# EasyEDA schematic Microcontroller board(Photodiode plate).json
TITLE: Sheet_1; REV: 1.0; Date: 2024-04-23; Sheet: 1/1; Company: Your Company
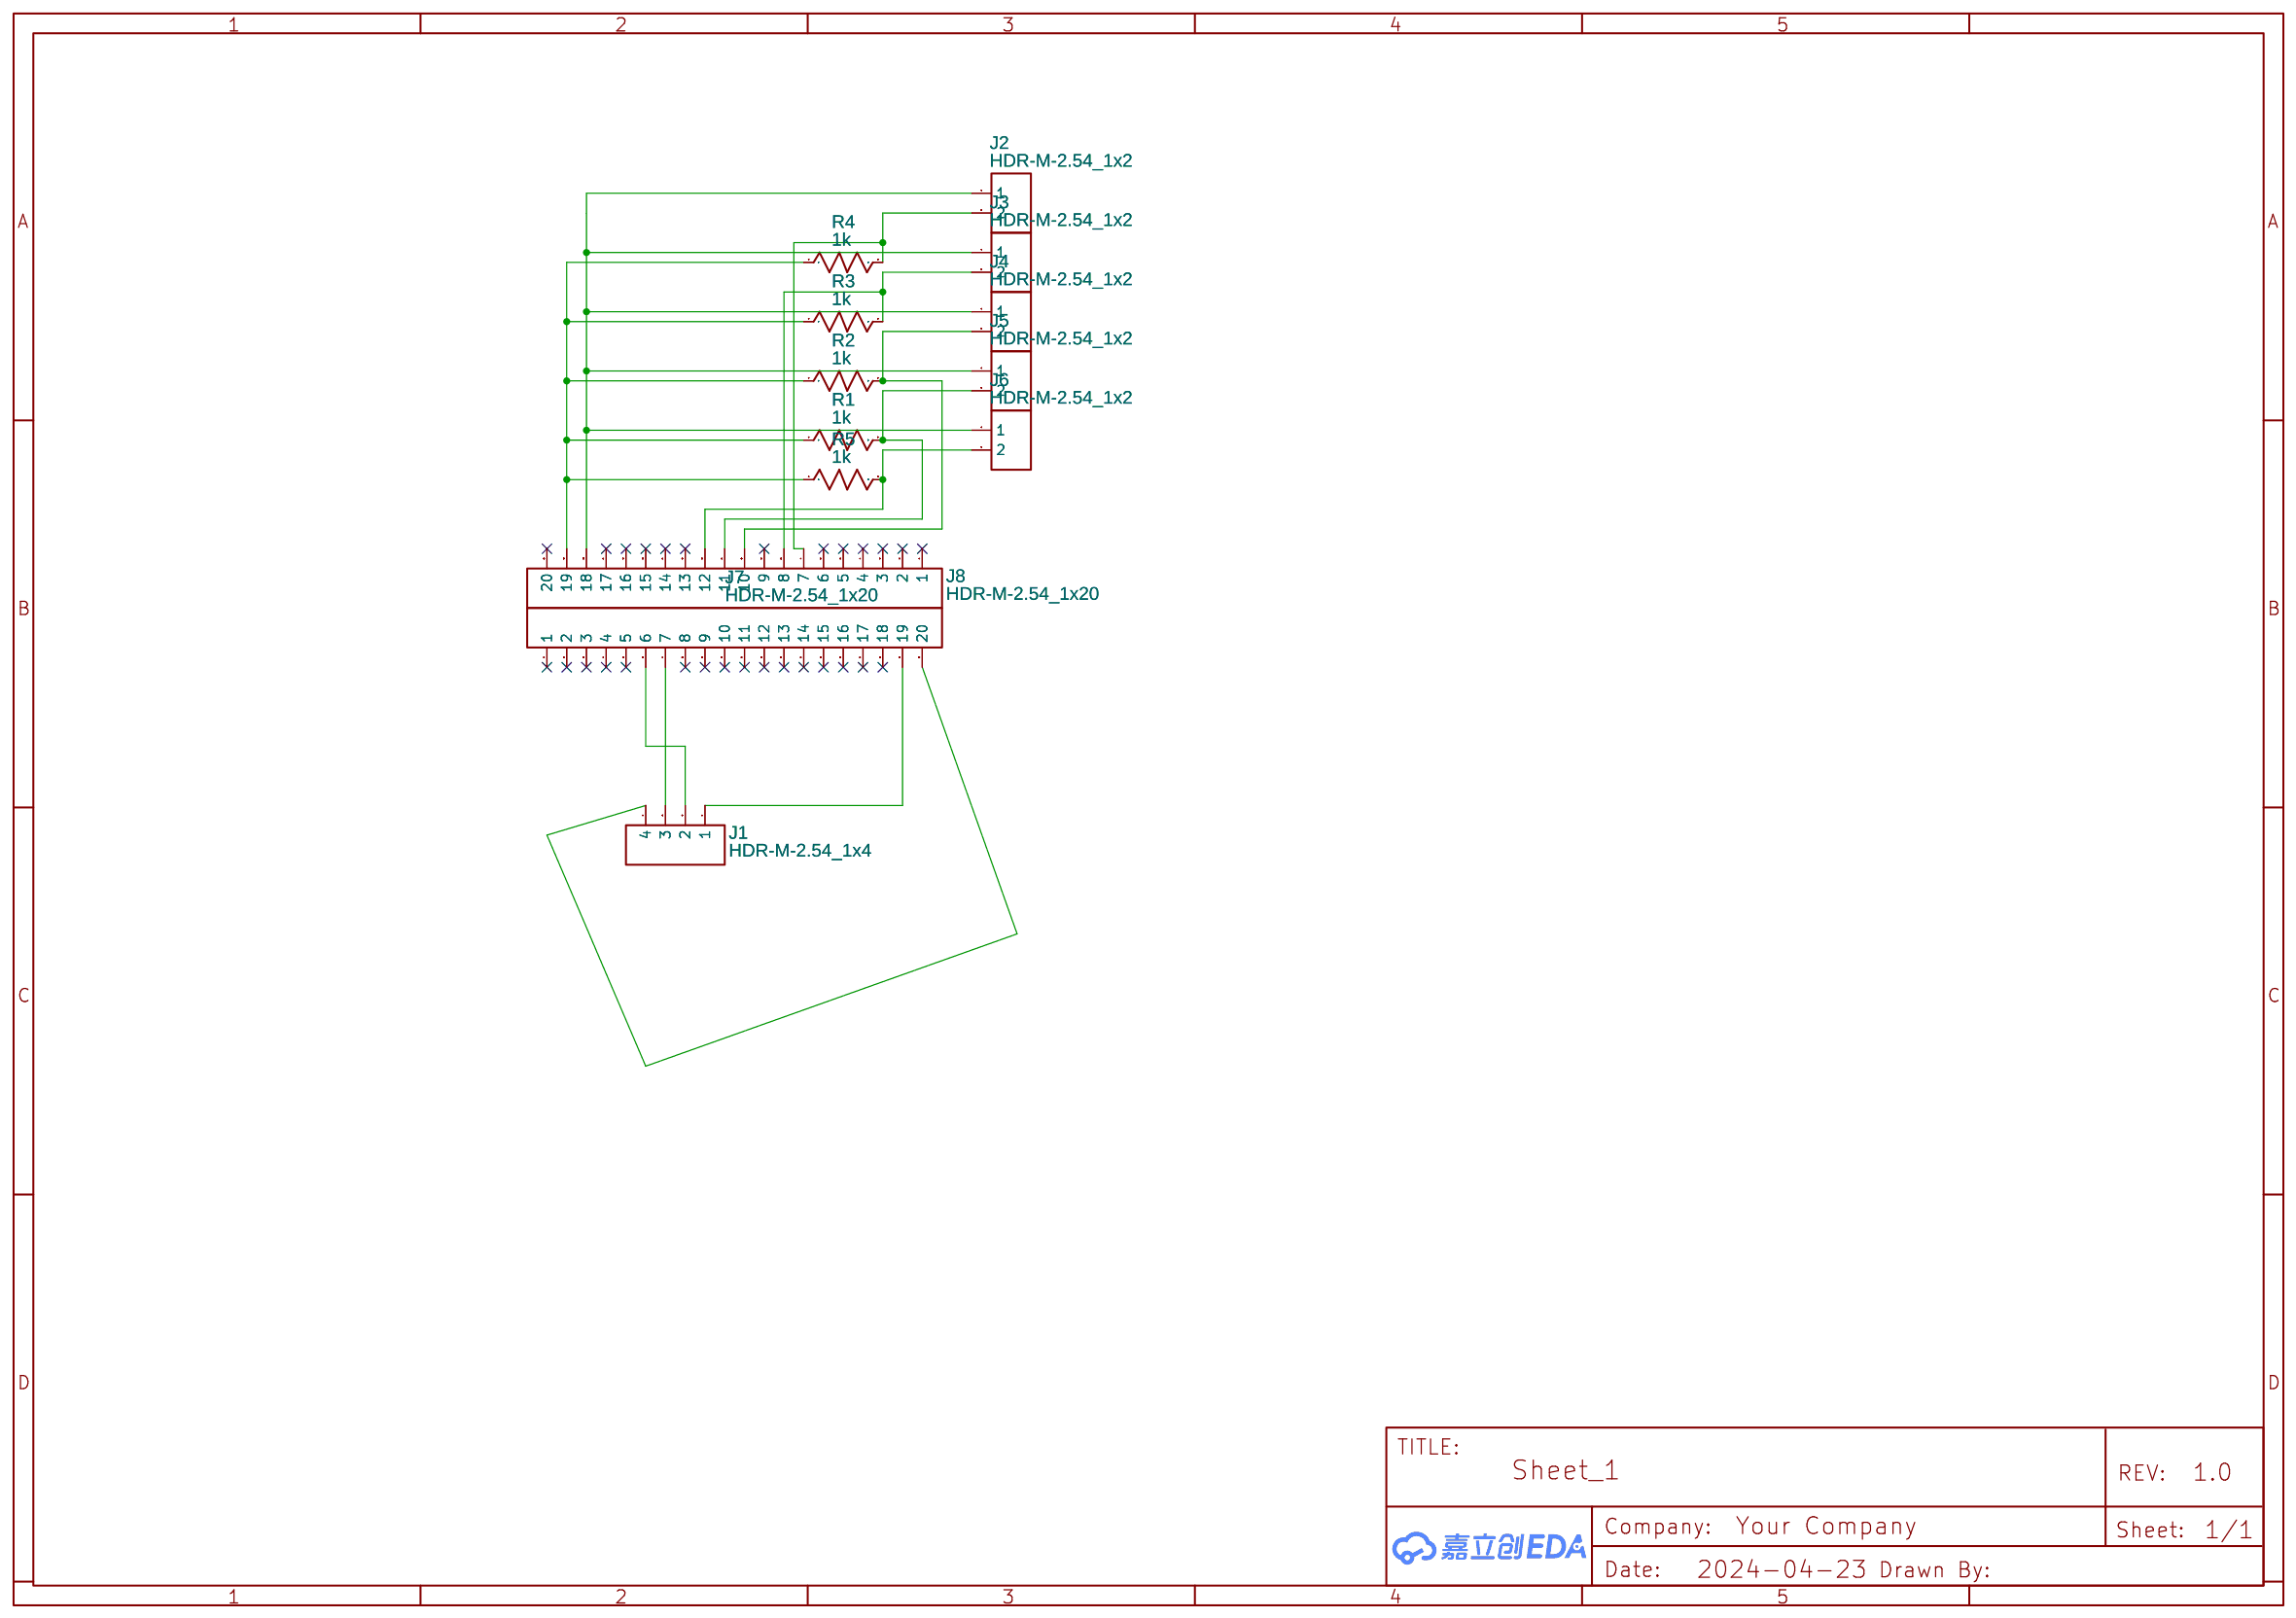
[diagram p0: schematic sheet]

## Parts
J1  HDR-M-2.54_1x4  [HDR-M-2.54_1X4]
J2  HDR-M-2.54_1x2  [HDR-M-2.54_1X2]
J3  HDR-M-2.54_1x2  [HDR-M-2.54_1X2]
J4  HDR-M-2.54_1x2  [HDR-M-2.54_1X2]
J5  HDR-M-2.54_1x2  [HDR-M-2.54_1X2]
J6  HDR-M-2.54_1x2  [HDR-M-2.54_1X2]
J7  HDR-M-2.54_1x20  [HDR-M-2.54_1X20]
J8  HDR-M-2.54_1x20  [HDR-M-2.54_1X20]
R1  1k  [R_AXIAL-0.4]
R2  1k  [R_AXIAL-0.4]
R3  1k  [R_AXIAL-0.4]
R4  1k  [R_AXIAL-0.4]
R5  1k  [R_AXIAL-0.4]

## Library data of the parts
J1 = HDR-M-2.54_1x4: Supplier Part: C124378; Supplier: LCSC; Contributor: LCEDA_Lib
J2-J6 = HDR-M-2.54_1x2: Supplier Part: C124375; Supplier: LCSC; Contributor: LCEDA_Lib
J7 J8 = HDR-M-2.54_1x20: Supplier Part: C50981; Supplier: LCSC; Contributor: LCEDA_Lib
R1-R5 = R_AXIAL-0.4_US: Contributor: LCEDA_Lib

## Nets
Net-(J1-1): J1.1 J7.19
Net-(J1-2): J1.2 J7.6
Net-(J1-3): J1.3 J7.7
Net-(J1-4): J1.4 J7.20
Net-(J2-1): J2.1 J3.1 J4.1 J5.1 J6.1 J8.18
Net-(J2-2): J2.2 J8.7 R4.2
Net-(J3-2): J3.2 J8.8 R3.2
Net-(J4-2): J4.2 J8.10 R2.2
Net-(J5-2): J5.2 J8.11 R1.2
Net-(J6-2): J6.2 J8.12 R5.2
Net-(J8-19): J8.19 R1.1 R2.1 R3.1 R4.1 R5.1

Not connected (* = marked no-connect by the designer): J7 1* 2* 3* 4* 5* 8* 9* 10* 11* 12* 13* 14* 15* 16* 17* 18*; J8 1* 2* 3* 4* 5* 6* 9* 13* 14* 15* 16* 17* 20*
